# Altium schematic sheet Sheet.SchDoc
size A4
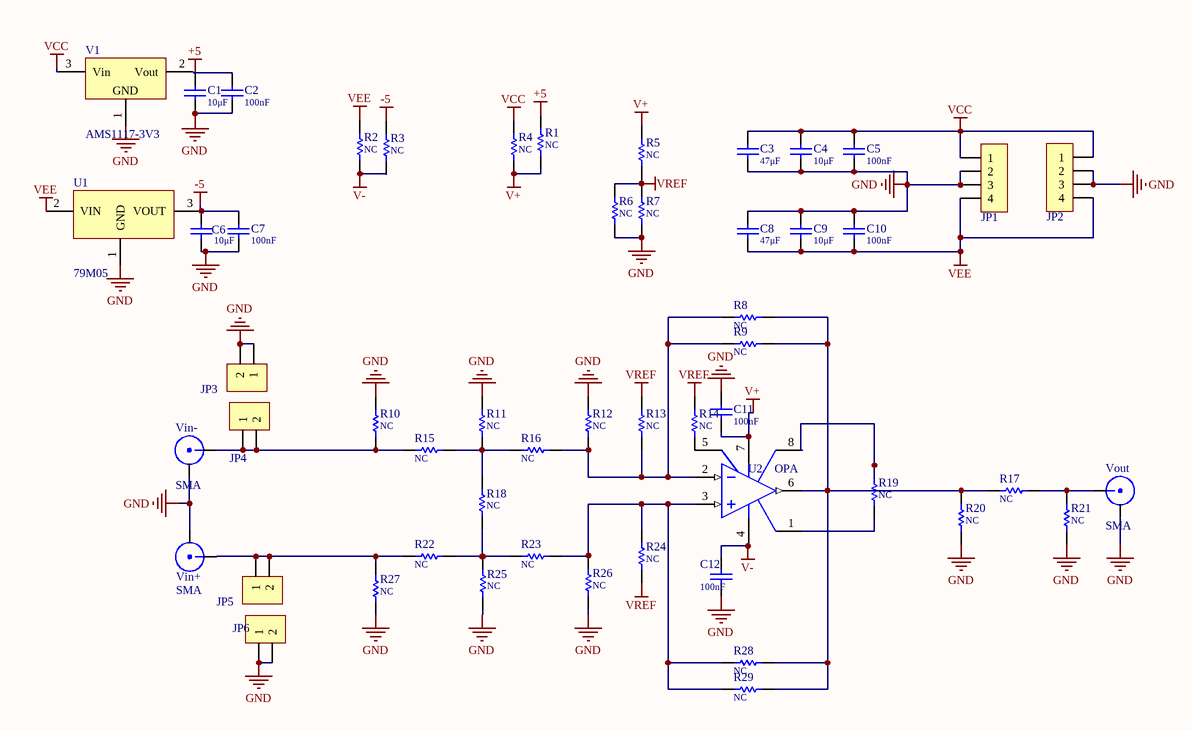
[diagram p0: Sheet.SchDoc]

## Parts
C1  value 10μF  [C0805-L]  (hidden comment: Cap-S)
C2  value 100nF  [C0603-L]  (hidden comment: Cap-S)
C3  value 47μF  [C0805-L]  (hidden comment: Cap-S)
C4  value 10μF  [C0805-L]  (hidden comment: Cap-S)
C5  value 100nF  [C0603-L]  (hidden comment: Cap-S)
C6  value 10μF  [C0805-L]  (hidden comment: Cap-S)
C7  value 100nF  [C0603-L]  (hidden comment: Cap-S)
C8  value 47μF  [C0805-L]  (hidden comment: Cap-S)
C9  value 10μF  [C0805-L]  (hidden comment: Cap-S)
C10  value 100nF  [C0603-L]  (hidden comment: Cap-S)
C11  value 100nF  [C0603-L]  (hidden comment: Cap-S)
C12  value 100nF  [C0603-L]  (hidden comment: Cap-S)
JP1  HDR-1X4  [VH3.96-LI-4P]  (value not drawn)
JP2  HDR-1X4  [VH3.96-LI-4P]  (value not drawn)
JP3  HDR-1X2  [HDR2.54-LI-2P]  (value not drawn)
JP4  HDR-1X2  [HDR2.54-LI-2P]  (value not drawn)
JP5  HDR-1X2  [HDR2.54-LI-2P]  (value not drawn)
JP6  HDR-1X2  [HDR2.54-LI-2P]  (value not drawn)
R1  value NC  [R0603-L]  (hidden comment: R)
R2  value NC  [R0603-L]  (hidden comment: R)
R3  value NC  [R0603-L]  (hidden comment: R)
R4  value NC  [R0603-L]  (hidden comment: R)
R5  value NC  [R0603-L]  (hidden comment: R)
R6  value NC  [R0603-L]  (hidden comment: R)
R7  value NC  [R0603-L]  (hidden comment: R)
R8  value NC  [R0603-L]  (hidden comment: R)
R9  value NC  [R0603-L]  (hidden comment: R)
R10  value NC  [R0603-L]  (hidden comment: R)
R11  value NC  [R0603-L]  (hidden comment: R)
R12  value NC  [R0603-L]  (hidden comment: R)
R13  value NC  [R0603-L]  (hidden comment: R)
R14  value NC  [R0603-L]  (hidden comment: R)
R15  value NC  [R0603-L]  (hidden comment: R)
R16  value NC  [R0603-L]  (hidden comment: R)
R17  value NC  [R0603-L]  (hidden comment: R)
R18  value NC  [R0603-L]  (hidden comment: R)
R19  value NC  [R0603-L]  (hidden comment: R)
R20  value NC  [R0603-L]  (hidden comment: R)
R21  value NC  [R0603-L]  (hidden comment: R)
R22  value NC  [R0603-L]  (hidden comment: R)
R23  value NC  [R0603-L]  (hidden comment: R)
R24  value NC  [R0603-L]  (hidden comment: R)
R25  value NC  [R0603-L]  (hidden comment: R)
R26  value NC  [R0603-L]  (hidden comment: R)
R27  value NC  [R0603-L]  (hidden comment: R)
R28  value NC  [R0603-L]  (hidden comment: R)
R29  value NC  [R0603-L]  (hidden comment: R)
U1  79M05  [TO252]
U2  OPA  [SOP8_N]
V1  AMS1117-3V3  [SOT223_L]
Vin+  SMA  [SMA1]
Vin-  SMA  [SMA1]
Vout  SMA  [SMA1]

## Nets
+5: C1.2 C2.2 R1.1 V1.2(Vout)
-5: C6.2 C7.2 R3.1 U1.3(VOUT)
GND: C1.1 C2.1 C3.1 C4.1 C5.1 C6.1 C7.1 C8.2 C9.2 C10.2 C11.2 C12.1 JP1.2 JP1.3 JP2.2 JP2.3 JP3.1 JP3.2 JP6.1 JP6.2 R6.2 R7.2 R10.2 R11.2 R12.2 R20.1 R21.1 R25.1 R26.1 R27.1 U1.1(GND) V1.1(GND) Vin+.2 Vin-.2 Vout.2
V+: C11.1 R1.2 R4.2 R5.1 U2.7
V-: C12.2 R2.2 R3.2 U2.4(V-)
VCC: C3.2 C4.2 C5.2 JP1.1 JP2.1 R4.1 V1.3(Vin)
VEE: C8.1 C9.1 C10.1 JP1.4 JP2.4 R2.1 U1.2(VIN)
VREF: R5.2 R6.1 R7.1 R13.2 R14.2 R24.1
NetJP4_1: JP4.1 JP4.2 R10.1 R15.1 Vin-.1
NetJP5_1: JP5.1 JP5.2 R22.1 R27.2 Vin+.1
NetR8_1: R8.1 R9.1 R12.1 R13.1 R16.2 U2.2(IN-)
NetR8_2: R8.2 R9.2 R17.1 R20.2 R28.2 R29.2 U2.6(OS_NUL)
NetR11_1: R11.1 R15.2 R16.1 R18.1
NetR14_1: R14.1 U2.5(NC)
NetR17_2: R17.2 R21.2 Vout.1
NetR18_2: R18.2 R22.2 R23.1 R25.2
NetR19_1: R19.1 U2.8
NetR19_2: R19.2 U2.1
NetR23_2: R23.2 R24.2 R26.2 R28.1 R29.1 U2.3(IN+)

## Library data of the parts
C1-C12 = Cap-S: 贴片瓷片电容
JP1 JP2 = Header 4: 4P接插件; 版权归属: 源创客; BOM名称: 4P接插件; 学习资源: www.ooocke.com
JP3-JP6 = Header 2: 2P接插件; 版权归属: 源创客; BOM名称: 2P接插件; 学习资源: www.ooocke.com
R1-R29 = Res: 贴片电阻
U1 = 79xx: 线性稳压芯片; 版权归属: 源创客; BOM名称: 线性稳压芯片; 学习资源: www.ooocke.com
U2 = OPA277: 双电源高精度运放; 版权归属: 源创客; BOM名称: 双电源高精度运放; 学习资源: www.ooocke.com
V1 = AMS1117: 三端稳压芯片; BOM名称: 稳压芯片; 版权归属: 源创客; 学习资源: www.ooocke.com